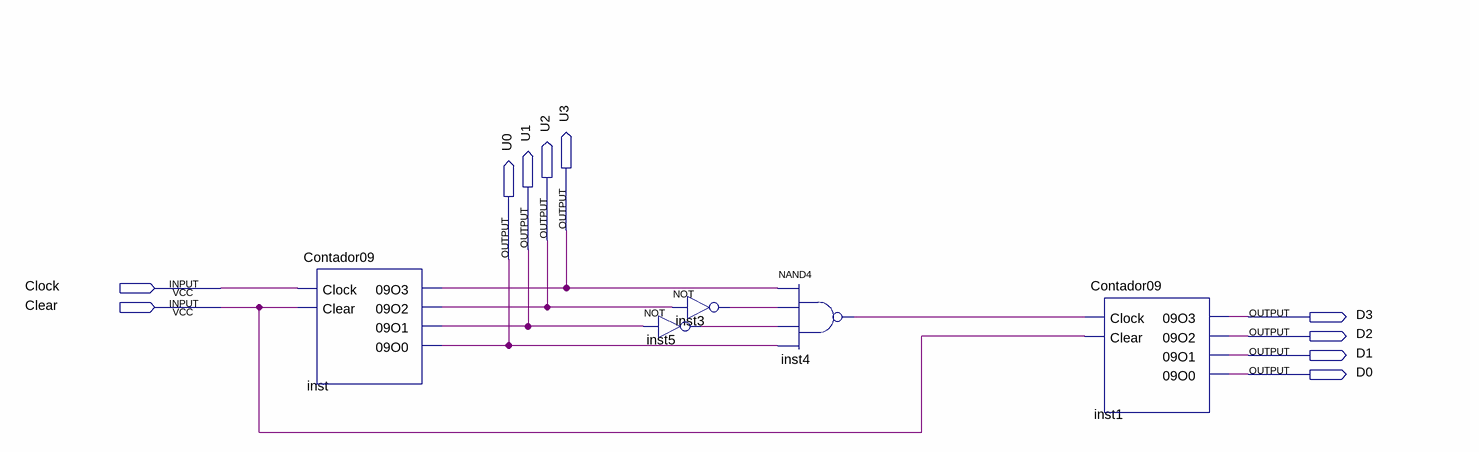
[diagram p0: schematic sheet]
// Quartus schematic Pontuação.bdf as structural Verilog: 5 symbols, 10 pins
module \Pontuação  (
  input  Clock,
  input  Clear,
  output U3,
  output U2,
  output U1,
  output U0,
  output D3,
  output D2,
  output D1,
  output D0
);

  wire inst3_out, inst4_out, inst5_out;

  Contador09 inst (.Clock(Clock), .Clear(Clear), .\09O3 (U3), .\09O2 (U2), .\09O1 (U1), .\09O0 (U0));
  not inst5 (inst5_out, U1);
  not inst3 (inst3_out, U2);
  nand inst4 (inst4_out, U3, inst3_out, inst5_out, U0);
  Contador09 inst1 (.Clock(inst4_out), .Clear(Clear), .\09O3 (D3), .\09O2 (D2), .\09O1 (D1), .\09O0 (D0));
endmodule
